# EAGLE schematic PowerSystemOverview2 (EAGLE 9.2.1)
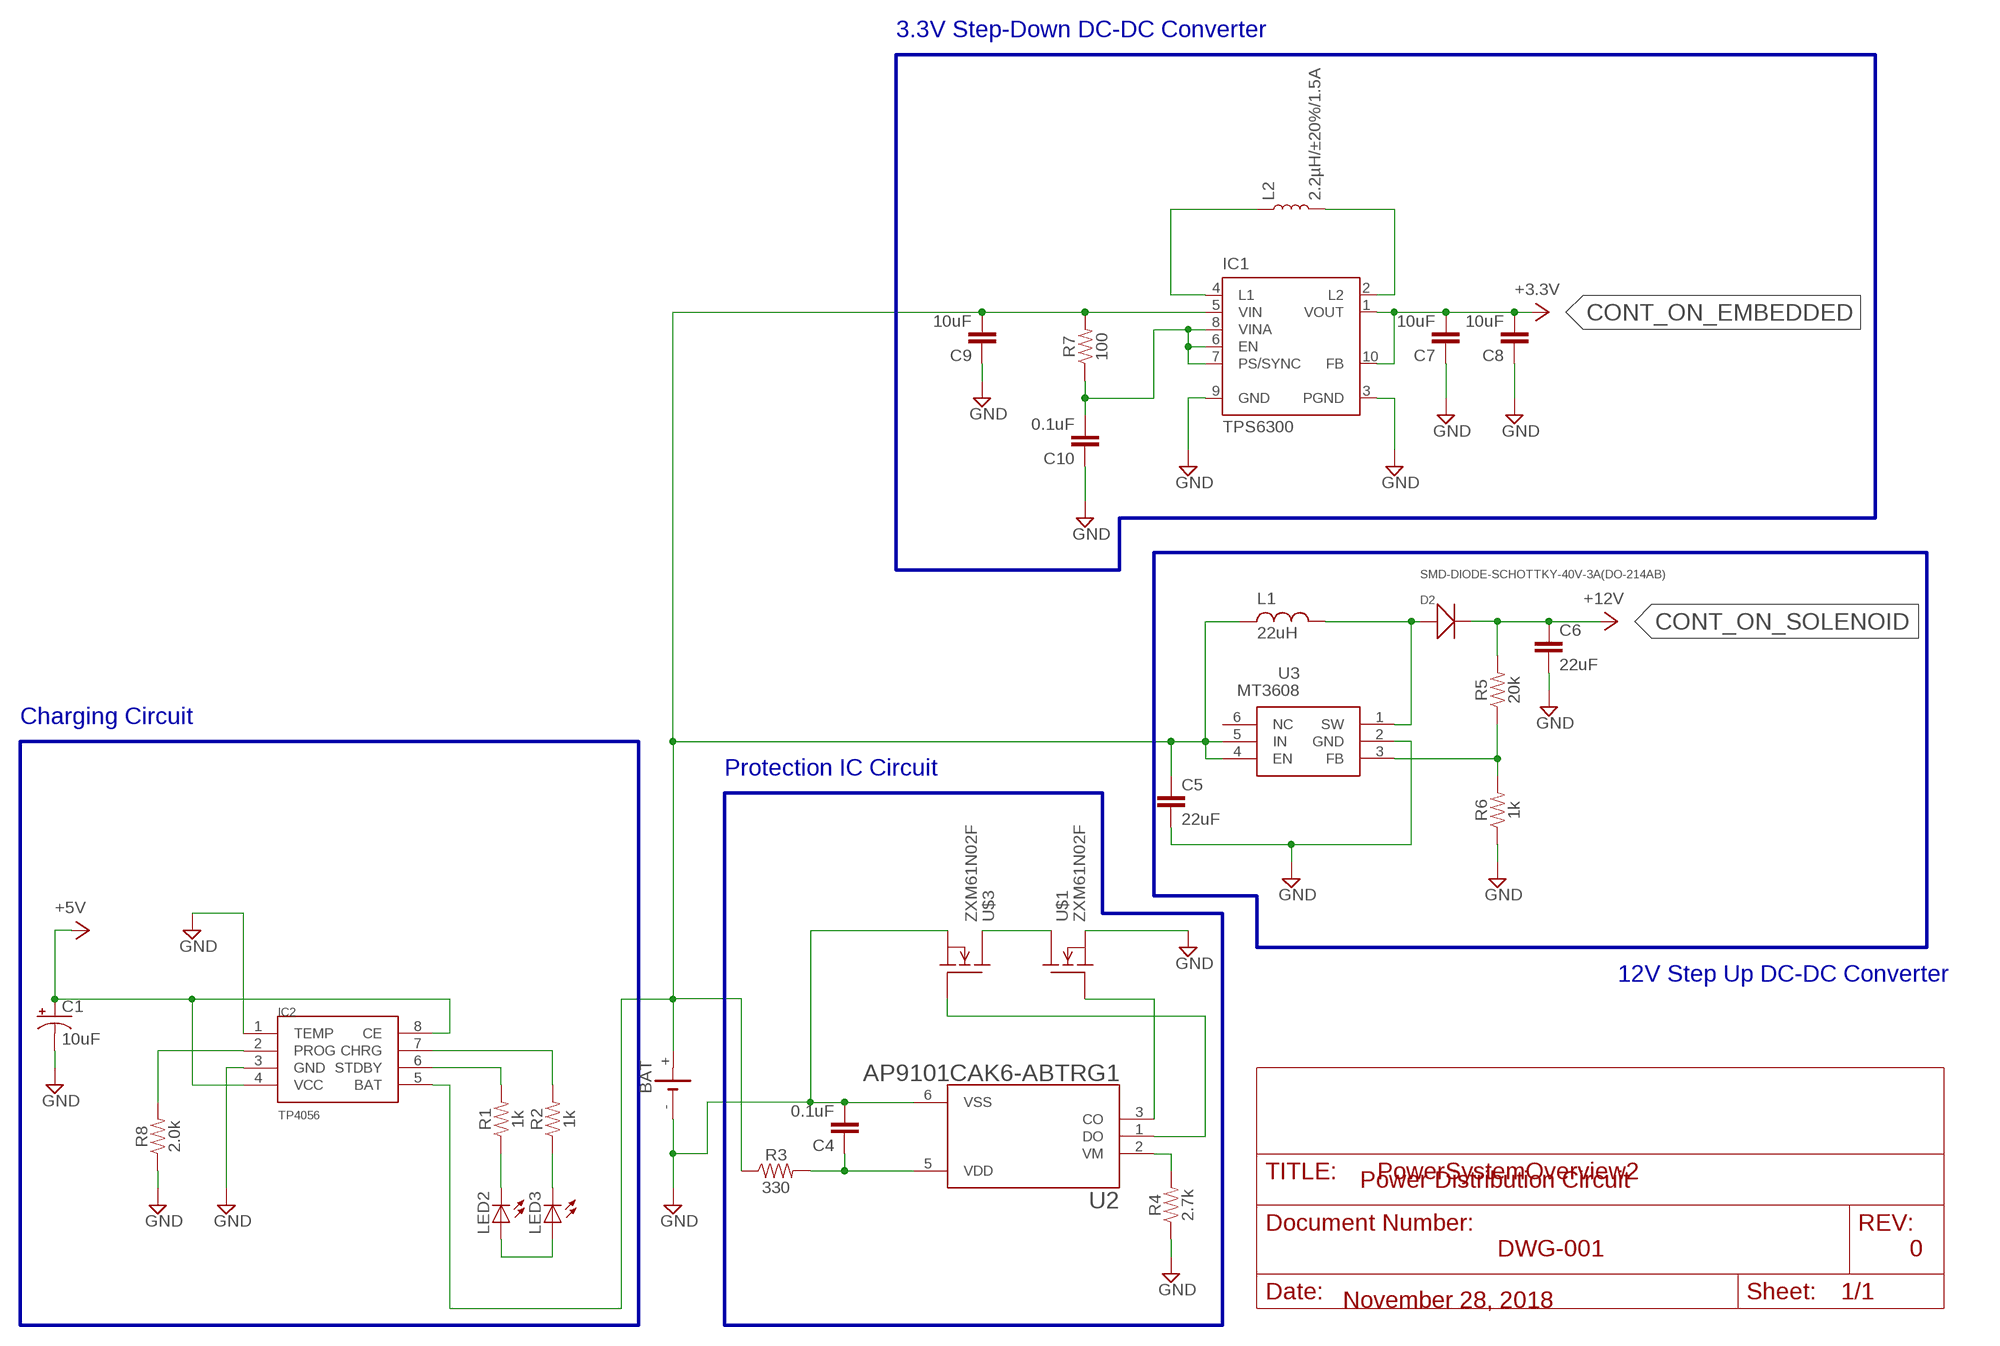
[diagram p0: schematic, sheet 1]

## Parts
BAT  SL-160AA/PR  [SL-160AA/PR]
C1  10uF  10UF-POLAR-0603-6.3V-20%(TANT)  [0603-POLAR]
C4  0.1uF  0.1UF-0402-16V-10%  [0402]
C5  22uF  22UF-0805-6.3V-20%  [0805]
C6  22uF  22UF-0805-6.3V-20%  [0805]
C7  10uF  10UF-0603-6.3V-20%  [0603]
C8  10uF  10UF-0603-6.3V-20%  [0603]
C9  10uF  10UF-0603-6.3V-20%  [0603]
C10  0.1uF  0.1UF-0402-16V-10%  [0402]
D2  SMD-DIODE-SCHOTTKY-40V-3A(DO-214AB)  [DO-214AB]
IC1  TPS6300  [DRC-S-PVSON-N10]
IC2  TP4056  [SOP-8]
L1  22uH  L  (no package)
L2  2.2µH/±20%/1.5A  INDUCTOR-VLF4012AT-2.2UH  [INDUCTOR_2.2UH]
LED2  TLLG4400  [LED3MM]
LED3  TLLG4400  [LED3MM]
R1  1k  1KOHM-0603-1/10W-1%  [0603]
R2  1k  1KOHM-0603-1/10W-1%  [0603]
R3  330  330OHM-0603-1/10W-1%  [0603]
R4  2.7k  2.55KOHM-0603-1/10W-1%  [0603]
R5  20k  20KOHM-0603-1/10W-1%  [0603]
R6  1k  1KOHM-0603-1/10W-1%  [0603]
R7  100  100OHM-0603-1/4W-5%  [0603]
R8  2.0k  2.0KOHM-0603-1/10W-5%  [0603]
U2  AP9101CAK6-ABTRG1  [SOT95P280X140-6N]
U3  MT3608  [SOT95P280X145-6N]
U$1  ZXM61N02F  [SOT23W]
U$3  ZXM61N02F  [SOT23W]

## Nets
+5V: C1.+ IC2.4(VCC) IC2.8(CE)
CONT_ON_EMBEDDED: C7.2 C8.2 IC1.1(VOUT) IC1.10(FB) ; supply symbol labelled +3.3V
CONT_ON_SOLENOID: C6.1 D2.2(-) R5.2 ; supply symbol labelled +12V
GND: BAT.- C1.- C4.2 C5.2 C6.2 C7.1 C8.1 C9.1 C10.1 IC1.3(PGND) IC1.9(GND) IC2.1(TEMP) IC2.3(GND) R4.1 R6.1 R8.1 U2.6(VSS) U3.2(GND) U$1.2(S) U$3.2(S)
N$1: BAT.+ C5.1 C9.2 IC1.5(VIN) IC2.5(BAT) L1.1 R3.1 R7.2 U3.4(EN) U3.5(IN)
N$4: LED2.A LED3.A
N$5: LED2.K(C) R1.1
N$6: LED3.K(C) R2.1
N$7: C4.1 R3.2 U2.5(VDD)
N$8: U$1.3(D) U$3.3(D)
N$9: R4.2 U2.2(VM)
N$10: U2.1(DO) U$3.1(G)
N$11: U2.3(CO) U$1.1(G)
N$12: D2.1(+) L1.2 U3.1(SW)
N$13: R5.1 R6.2 U3.3(FB)
N$14: C10.2 IC1.6(EN) IC1.7(PS/SYNC) IC1.8(VINA) R7.1
N$15: IC1.4(L1) L2.P$1
N$16: IC1.2(L2) L2.P$2
N$17: IC2.6(STDBY) R1.2
N$18: IC2.7(CHRG) R2.2
N$19: IC2.2(PROG) R8.2
Unconnected: IC1.TH U3.6(NC)

## Buses
B$1
B$2
B$3
B$4

## Notes on the sheet
- 3.3V Step-Down DC-DC Converter
- Charging Circuit
- Protection IC Circuit
- 12V Step Up DC-DC Converter
- Power Distribution Circuit
- DWG-001 | 0
- November 28, 2018

## Library data of the parts
BAT = battery:SL-160AA/PR: LI BATTERY Sonnenschein
C1 = SparkFun-Capacitors:10UF-POLAR: 10.0µF polarized capacitors A capacitor is a passive two-terminal electrical component used to store electrical energy temporarily in an electric field.; PROD_ID: CAP-13210
C4 C10 = SparkFun-Capacitors:0.1UF: 0.1µF ceramic capacitors A capacitor is a passive two-terminal electrical component used to store electrical energy temporarily in an electric field.; PROD_ID: CAP-12416
C5 C6 = SparkFun-Capacitors:22UF: 22µF ceramic capacitors A capacitor is a passive two-terminal electrical component used to store electrical energy temporarily in an electric field.; PROD_ID: CAP-08402
C7-C9 = SparkFun-Capacitors:10UF: 10.0µF ceramic capacitors A capacitor is a passive two-terminal electrical component used to store electrical energy temporarily in an electric field.; PROD_ID: CAP-11015
D2 = SMD-DIODE-SCHOTTKY-40V-3A_DO-214AB_:SMD-DIODE-SCHOTTKY-40V-3A(DO-214AB): 304020018; AVAILABILITY: Unavailable; DESCRIPTION: Rectifier, Schottky; DO-214AB; 3.0A IF; 0.75V; 40V; 100A IFRM; 10000V/us; 1000pF; MF: Vishay; MP: SS34-E3/57T; PACKAGE: DO-214 Vishay; PRICE: None
IC1 = texas:TPS6300*: HIGH EFFICIENT SINGLE INDUCTOR BUCK-BOOST CONVERTER WITH 1.8-A SWITCHES Source: http://focus.ti.com/lit/ds/symlink/tps63001.pdf; MPN: TPS63000DRCTG4; OC_FARNELL: 1511852; OC_NEWARK: 59M7217
IC2 = TP4056:TP4056; AVAILABILITY: Unavailable; MF: NanJing Top Power ASIC Corp.; MP: TP4056; PACKAGE: Package Analog Devices; PRICE: None
L1 = ngspice-simulation:L: INDUCTOR
L2 = SparkFun-Coils:INDUCTOR: Inductors Resist changes in electrical current. Basically a coil of wire. SparkFun Products: SparkFun Load Cell Amplifier - HX711 <https://www.sparkfun.com/products/13879> IOIO-OTG - V2.2 <https://www.sparkfun.com/products/13613>; PROD_ID: NDUC-09513
LED2 LED3 = led:TLLG4400: Low Current (2mA) LED 3 mm Tinted Diffused Package color GREEN Source: Data sheet <http://www.farnell.com/datasheets/391098.pdf>; MF: VISHAY SEMICONDUCTOR; OC_FARNELL: 1612435
R1 R2 R6 = SparkFun-Resistors:1KOHM: 1kΩ resistor A resistor is a passive two-terminal electrical component that implements electrical resistance as a circuit element. Resistors act to reduce current flow, and, at the same time, act to lower voltage levels within circuits. - Wikipedia; PROD_ID: RES-07856
R3 = SparkFun-Resistors:330OHM: 330Ω resistor A resistor is a passive two-terminal electrical component that implements electrical resistance as a circuit element. Resistors act to reduce current flow, and, at the same time, act to lower voltage levels within circuits. - Wikipedia; PROD_ID: RES-00818
R4 = SparkFun-Resistors:2.55KOHM: 2.55kΩ resistor A resistor is a passive two-terminal electrical component that implements electrical resistance as a circuit element. Resistors act to reduce current flow, and, at the same time, act to lower voltage levels within circuits. - Wikipedia; PROD_ID: RES-11227; VALUE: 2.55k
R5 = SparkFun-Resistors:20KOHM: 20kΩ resistor A resistor is a passive two-terminal electrical component that implements electrical resistance as a circuit element. Resistors act to reduce current flow, and, at the same time, act to lower voltage levels within circuits. - Wikipedia; PROD_ID: RES-09383
R7 = SparkFun-Resistors:100OHM: 100Ω resistor A resistor is a passive two-terminal electrical component that implements electrical resistance as a circuit element. Resistors act to reduce current flow, and, at the same time, act to lower voltage levels within circuits. - Wikipedia; PROD_ID: RES-12438
R8 = SparkFun-Resistors:2.0KOHM: 2kΩ resistor A resistor is a passive two-terminal electrical component that implements electrical resistance as a circuit element. Resistors act to reduce current flow, and, at the same time, act to lower voltage levels within circuits. - Wikipedia; PROD_ID: RES-08296
U2 = AP9101CAK6-ABTRG1:AP9101CAK6-ABTRG1: Ic Batt Prot Li-Ion 1-Cell Sot26; AVAILABILITY: Unavailable; DESCRIPTION: Battery Protection Li-Ion/Li-Pol Packs 2.5V to 4.425V 6-Pin SOT-26 T/R; MF: Diodes Inc.; MP: AP9101CAK6-ABTRG1; PACKAGE: SOT-23 Diodes Inc.; PRICE: None
U3 = MT3608:MT3608: High Efficiency 1.2MHz 2A Step Up Converter Source: Datasheet <https://www.olimex.com/Products/Breadboarding/BB-PWR-3608/resources/MT3608.pdf>; ARROW_PART_NUMBER: MT3608; DESCRIPTION: High Efficiency 1.2MHz 2A Step Up Converter; HEIGHT: 1.45mm; MANUFACTURER_NAME: Aerosemi; MANUFACTURER_PART_NUMBER: MT3608
U$1 U$3 = ZXM61N02F:ZXM61N02F: N-Ch Enhancement MOSFET, Logic Level (SOT23); AVAILABILITY: Unavailable; DESCRIPTION: N CHANNEL MOSFET, 20V, 1.7A, SOT-23; Transistor Polarity: N Channel; Continuous Drain Current Id: 1.7A; Drain Source ...; MF: Diodes Inc.; MP: ZXM61N02F; PACKAGE: SOT-23-3 Diodes Inc.; PRICE: None